# EAGLE design AB-AudioMatrix-6x6 (EAGLE 9.5.2)
DATE: 26.04.2020; EDITOR: HansAchterbahn; PROJECT: AB AudioMatrix 6x6; VERSION: v3.4

## Sheet 1 of 2
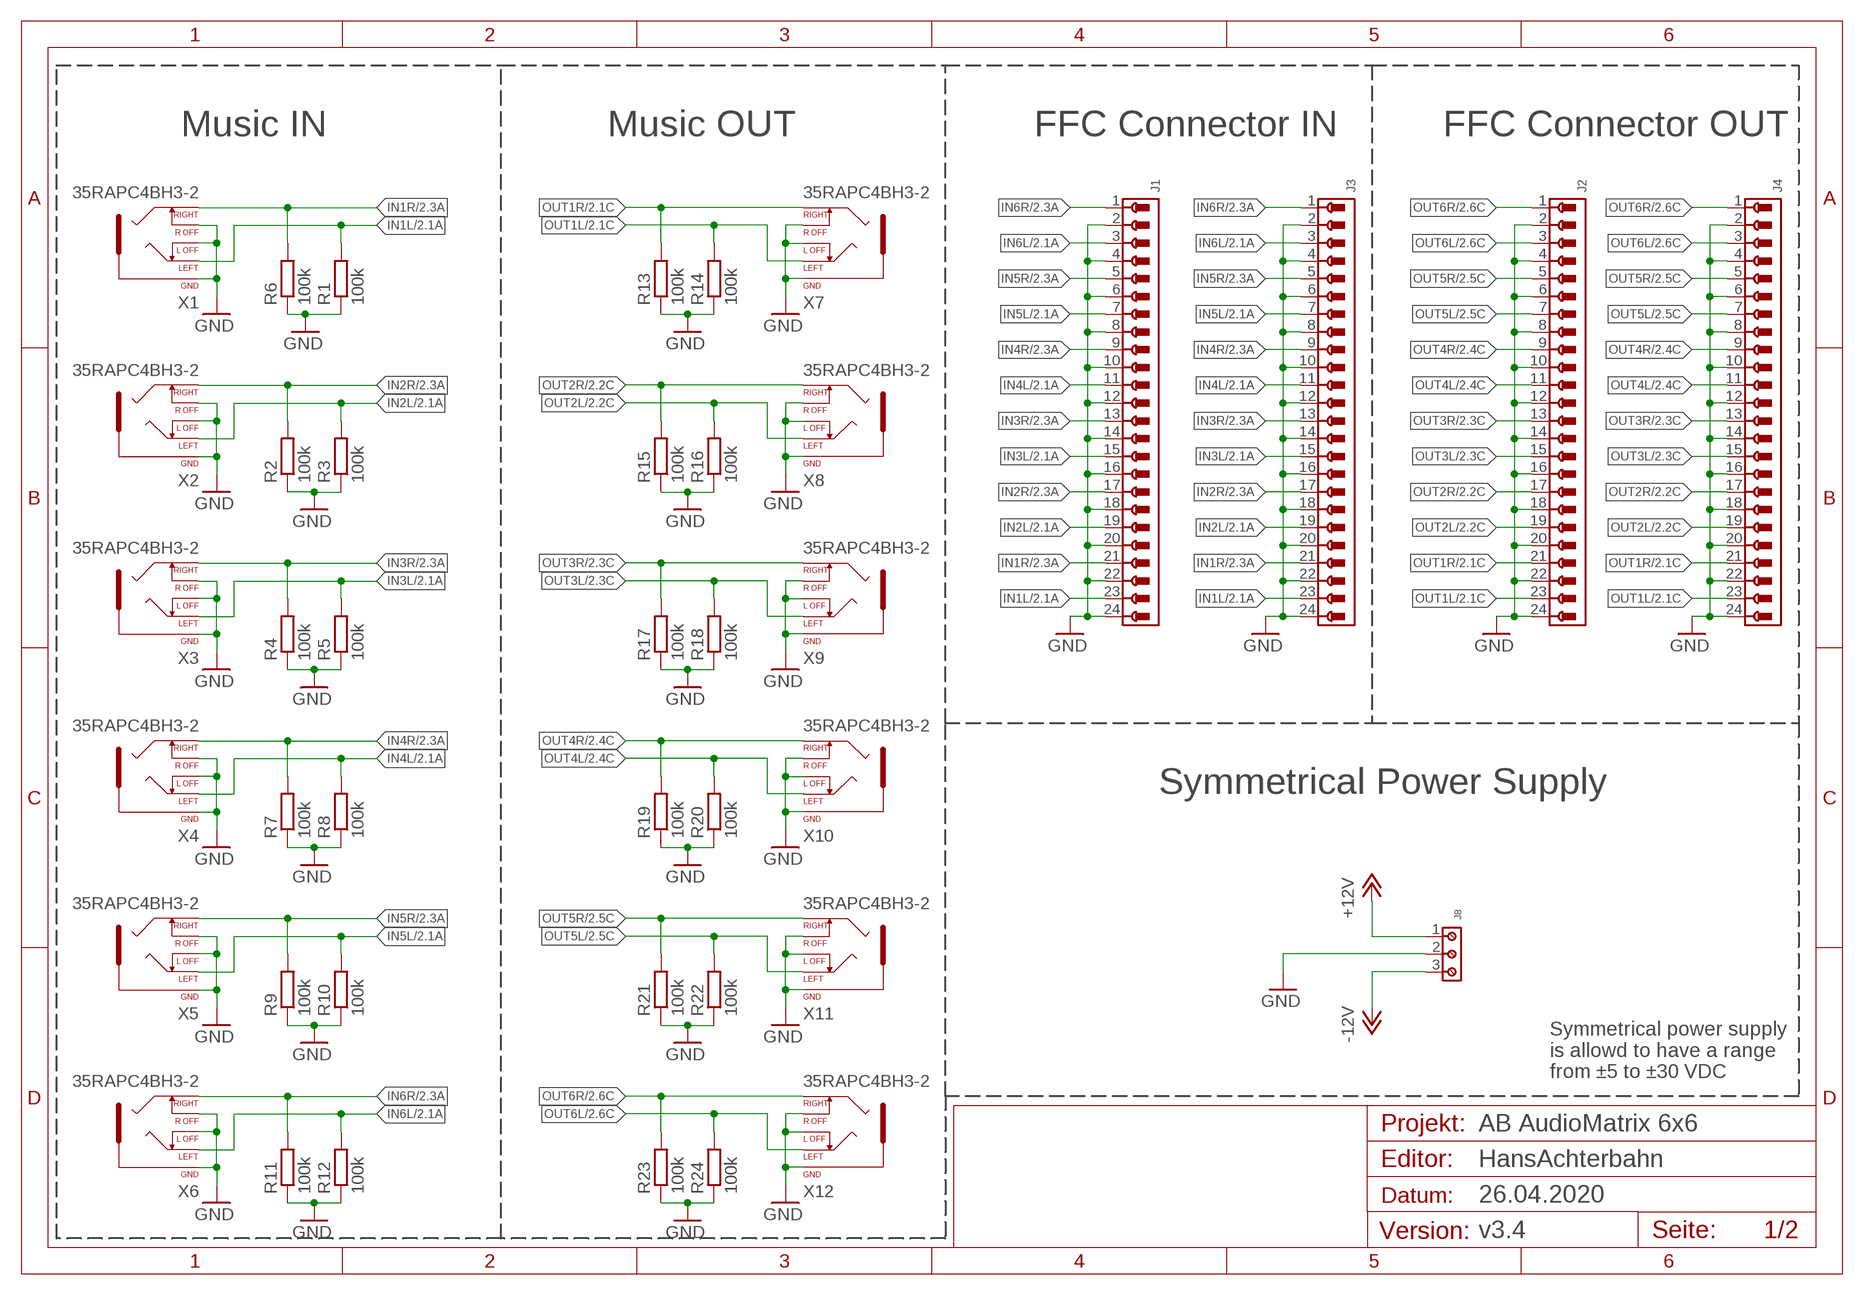
[diagram p0: schematic, sheet 1]

### Parts
J1  6861XX188622_686124188622  [686124188622]
J2  6861XX188622_686124188622  [686124188622]
J3  6861XX188622_686124188622  [686124188622]
J4  6861XX188622_686124188622  [686124188622]
J8  691102710003  [691102710003]
R1  100k  R-EU_R0603  [R0603]
R2  100k  R-EU_R0603  [R0603]
R3  100k  R-EU_R0603  [R0603]
R4  100k  R-EU_R0603  [R0603]
R5  100k  R-EU_R0603  [R0603]
R6  100k  R-EU_R0603  [R0603]
R7  100k  R-EU_R0603  [R0603]
R8  100k  R-EU_R0603  [R0603]
R9  100k  R-EU_R0603  [R0603]
R10  100k  R-EU_R0603  [R0603]
R11  100k  R-EU_R0603  [R0603]
R12  100k  R-EU_R0603  [R0603]
R13  100k  R-EU_R0603  [R0603]
R14  100k  R-EU_R0603  [R0603]
R15  100k  R-EU_R0603  [R0603]
R16  100k  R-EU_R0603  [R0603]
R17  100k  R-EU_R0603  [R0603]
R18  100k  R-EU_R0603  [R0603]
R19  100k  R-EU_R0603  [R0603]
R20  100k  R-EU_R0603  [R0603]
R21  100k  R-EU_R0603  [R0603]
R22  100k  R-EU_R0603  [R0603]
R23  100k  R-EU_R0603  [R0603]
R24  100k  R-EU_R0603  [R0603]
X1  35RAPC4BH3-2  [SWITCHCRAFT_35RAPC4BH3]
X2  35RAPC4BH3-2  [SWITCHCRAFT_35RAPC4BH3]
X3  35RAPC4BH3-2  [SWITCHCRAFT_35RAPC4BH3]
X4  35RAPC4BH3-2  [SWITCHCRAFT_35RAPC4BH3]
X5  35RAPC4BH3-2  [SWITCHCRAFT_35RAPC4BH3]
X6  35RAPC4BH3-2  [SWITCHCRAFT_35RAPC4BH3]
X7  35RAPC4BH3-2  [SWITCHCRAFT_35RAPC4BH3]
X8  35RAPC4BH3-2  [SWITCHCRAFT_35RAPC4BH3]
X9  35RAPC4BH3-2  [SWITCHCRAFT_35RAPC4BH3]
X10  35RAPC4BH3-2  [SWITCHCRAFT_35RAPC4BH3]
X11  35RAPC4BH3-2  [SWITCHCRAFT_35RAPC4BH3]
X12  35RAPC4BH3-2  [SWITCHCRAFT_35RAPC4BH3]

### Nets
+12V: J8.1 ; also sheet 2
-12V: J8.3 ; also sheet 2
GND: J1.2 J1.4 J1.6 J1.8 J1.10 J1.12 J1.14 J1.16 J1.18 J1.20 J1.22 J1.24 J2.2 J2.4 J2.6 J2.8 J2.10 J2.12 J2.14 J2.16 J2.18 J2.20 J2.22 J2.24 J3.2 J3.4 J3.6 J3.8 J3.10 J3.12 J3.14 J3.16 J3.18 J3.20 J3.22 J3.24 J4.2 J4.4 J4.6 J4.8 J4.10 J4.12 J4.14 J4.16 J4.18 J4.20 J4.22 J4.24 J8.2 R1.1 R2.1 R3.1 R4.1 R5.1 R6.1 R7.1 R8.1 R9.1 R10.1 R11.1 R12.1 R13.1 R14.1 R15.1 R16.1 R17.1 R18.1 R19.1 R20.1 R21.1 R22.1 R23.1 R24.1 X1.1(GND) X1.3(RIGHT_OFF) X1.4(LEFT_OFF) X2.1(GND) X2.3(RIGHT_OFF) X2.4(LEFT_OFF) X3.1(GND) X3.3(RIGHT_OFF) X3.4(LEFT_OFF) X4.1(GND) X4.3(RIGHT_OFF) X4.4(LEFT_OFF) X5.1(GND) X5.3(RIGHT_OFF) X5.4(LEFT_OFF) X6.1(GND) X6.3(RIGHT_OFF) X6.4(LEFT_OFF) X7.1(GND) X7.3(RIGHT_OFF) X7.4(LEFT_OFF) X8.1(GND) X8.3(RIGHT_OFF) X8.4(LEFT_OFF) X9.1(GND) X9.3(RIGHT_OFF) X9.4(LEFT_OFF) X10.1(GND) X10.3(RIGHT_OFF) X10.4(LEFT_OFF) X11.1(GND) X11.3(RIGHT_OFF) X11.4(LEFT_OFF) X12.1(GND) X12.3(RIGHT_OFF) X12.4(LEFT_OFF)
IN1L: J1.23 J3.23 R1.2 X1.5(LEFT) ; also sheet 2
IN1R: J1.21 J3.21 R6.2 X1.2(RIGHT) ; also sheet 2
IN2L: J1.19 J3.19 R3.2 X2.5(LEFT) ; also sheet 2
IN2R: J1.17 J3.17 R2.2 X2.2(RIGHT) ; also sheet 2
IN3L: J1.15 J3.15 R5.2 X3.5(LEFT) ; also sheet 2
IN3R: J1.13 J3.13 R4.2 X3.2(RIGHT) ; also sheet 2
IN4L: J1.11 J3.11 R8.2 X4.5(LEFT) ; also sheet 2
IN4R: J1.9 J3.9 R7.2 X4.2(RIGHT) ; also sheet 2
IN5L: J1.7 J3.7 R10.2 X5.5(LEFT) ; also sheet 2
IN5R: J1.5 J3.5 R9.2 X5.2(RIGHT) ; also sheet 2
IN6L: J1.3 J3.3 R12.2 X6.5(LEFT) ; also sheet 2
IN6R: J1.1 J3.1 R11.2 X6.2(RIGHT) ; also sheet 2
OUT1L: J2.23 J4.23 R14.2 X7.5(LEFT) ; also sheet 2
OUT1R: J2.21 J4.21 R13.2 X7.2(RIGHT) ; also sheet 2
OUT2L: J2.19 J4.19 R16.2 X8.5(LEFT) ; also sheet 2
OUT2R: J2.17 J4.17 R15.2 X8.2(RIGHT) ; also sheet 2
OUT3L: J2.15 J4.15 R18.2 X9.5(LEFT) ; also sheet 2
OUT3R: J2.13 J4.13 R17.2 X9.2(RIGHT) ; also sheet 2
OUT4L: J2.11 J4.11 R20.2 X10.5(LEFT) ; also sheet 2
OUT4R: J2.9 J4.9 R19.2 X10.2(RIGHT) ; also sheet 2
OUT5L: J2.7 J4.7 R22.2 X11.5(LEFT) ; also sheet 2
OUT5R: J2.5 J4.5 R21.2 X11.2(RIGHT) ; also sheet 2
OUT6L: J2.3 J4.3 R24.2 X12.5(LEFT) ; also sheet 2
OUT6R: J2.1 J4.1 R23.2 X12.2(RIGHT) ; also sheet 2

### Notes on the sheet
- Music IN | Music OUT | FFC Connector IN | FFC Connector OUT
- Symmetrical Power Supply
- Symmetrical power supply 
  is allowd to have a range 
  from ±5 to ±30 VDC

## Sheet 2 of 2
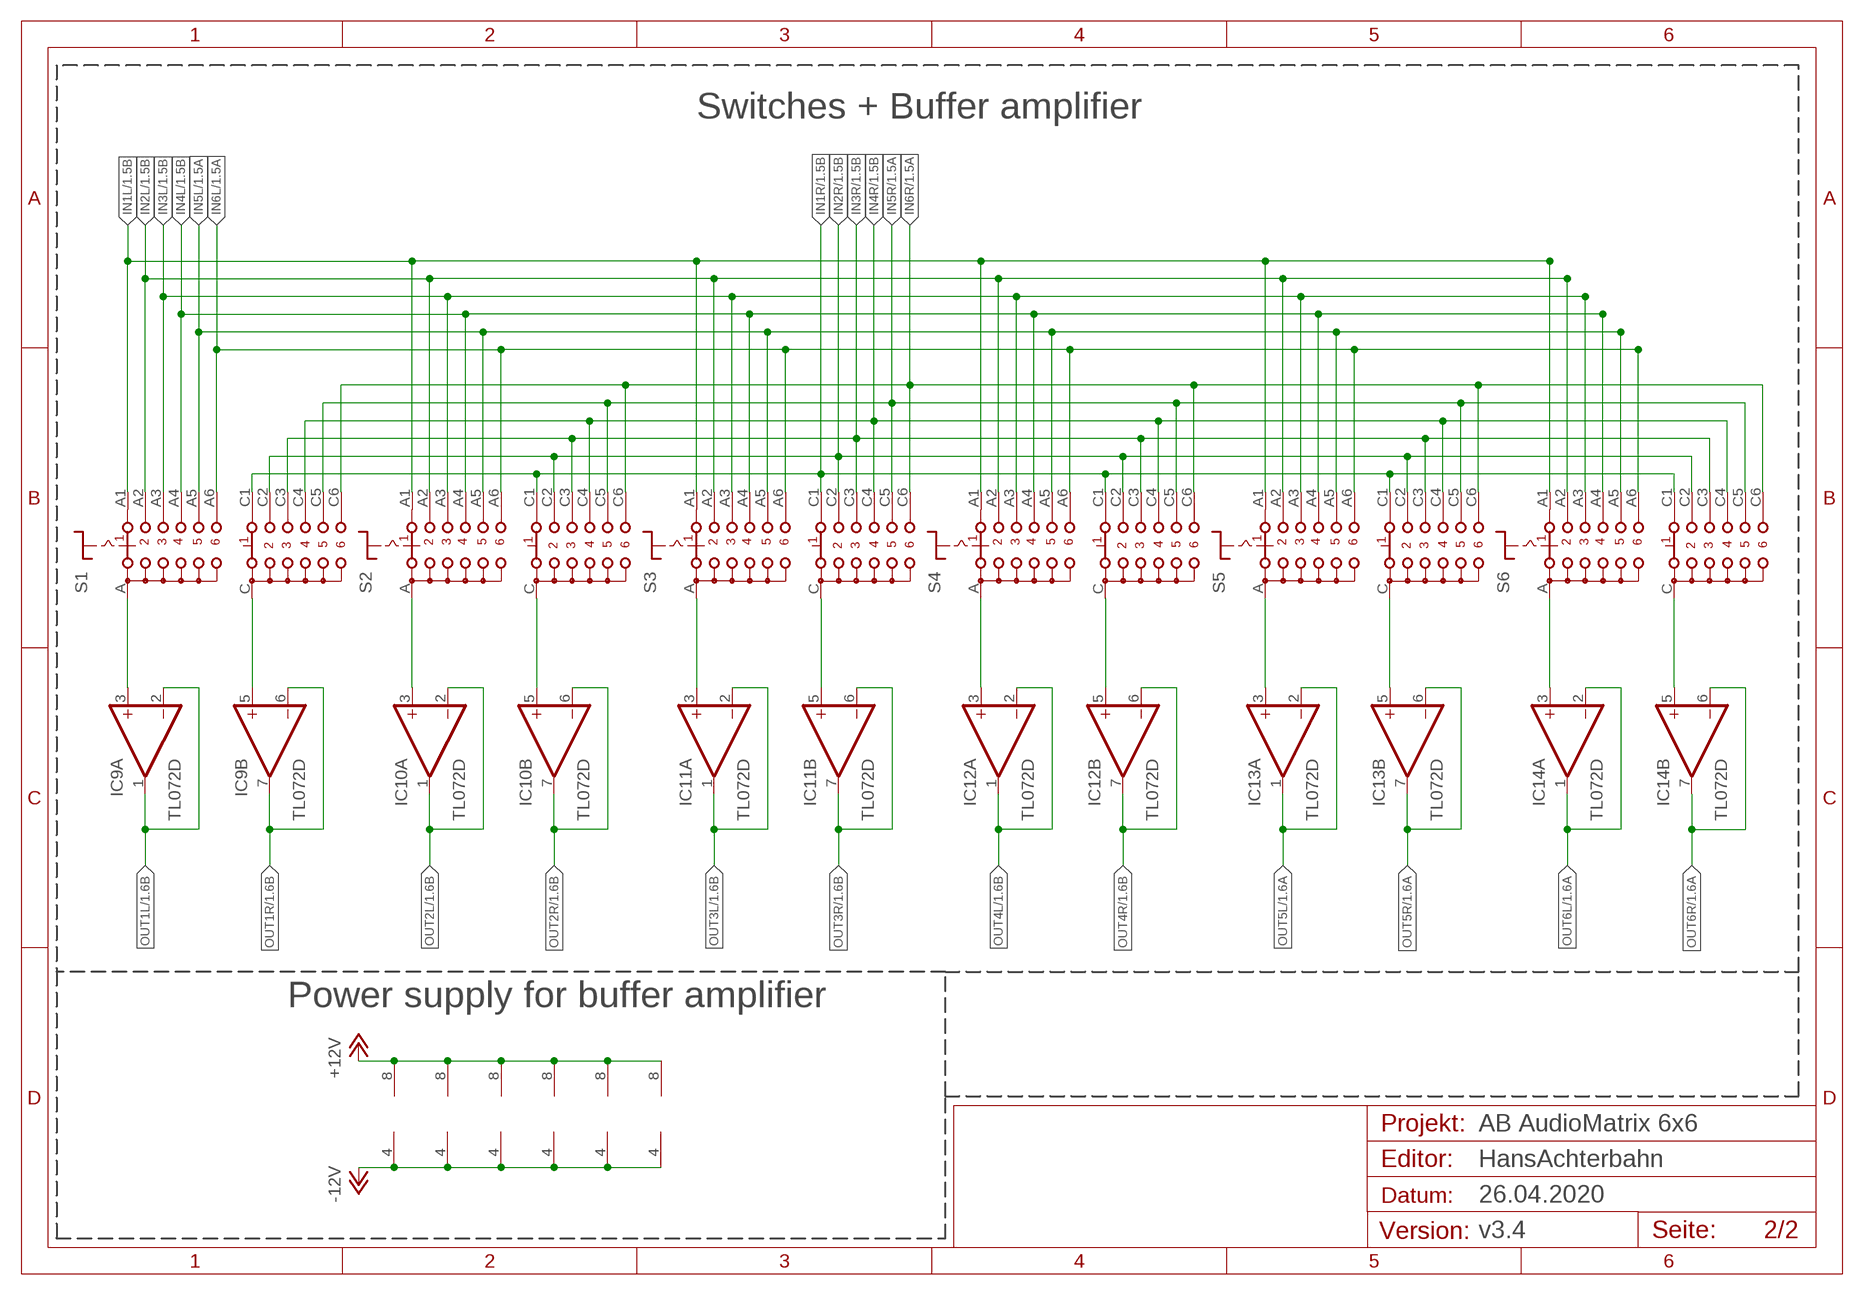
[diagram p1: schematic, sheet 2]

### Parts
IC9  TL072D  [SO08]
IC10  TL072D  [SO08]
IC11  TL072D  [SO08]
IC12  TL072D  [SO08]
IC13  TL072D  [SO08]
IC14  TL072D  [SO08]
S1  CK102X06  [CK102X06]
S2  CK102X06  [CK102X06]
S3  CK102X06  [CK102X06]
S4  CK102X06  [CK102X06]
S5  CK102X06  [CK102X06]
S6  CK102X06  [CK102X06]

### Nets
+12V: IC9.8(P:V+) IC10.8(P:V+) IC11.8(P:V+) IC12.8(P:V+) IC13.8(P:V+) IC14.8(P:V+) ; also sheet 1
-12V: IC9.4(P:V-) IC10.4(P:V-) IC11.4(P:V-) IC12.4(P:V-) IC13.4(P:V-) IC14.4(P:V-) ; also sheet 1
IN1L: S1.A1 S2.A1 S3.A1 S4.A1 S5.A1 S6.A1 ; also sheet 1
IN1R: S1.C1 S2.C1 S3.C1 S4.C1 S5.C1 S6.C1 ; also sheet 1
IN2L: S1.A2 S2.A2 S3.A2 S4.A2 S5.A2 S6.A2 ; also sheet 1
IN2R: S1.C2 S2.C2 S3.C2 S4.C2 S5.C2 S6.C2 ; also sheet 1
IN3L: S1.A3 S2.A3 S3.A3 S4.A3 S5.A3 S6.A3 ; also sheet 1
IN3R: S1.C3 S2.C3 S3.C3 S4.C3 S5.C3 S6.C3 ; also sheet 1
IN4L: S1.A4 S2.A4 S3.A4 S4.A4 S5.A4 S6.A4 ; also sheet 1
IN4R: S1.C4 S2.C4 S3.C4 S4.C4 S5.C4 S6.C4 ; also sheet 1
IN5L: S1.A5 S2.A5 S3.A5 S4.A5 S5.A5 S6.A5 ; also sheet 1
IN5R: S1.C5 S2.C5 S3.C5 S4.C5 S5.C5 S6.C5 ; also sheet 1
IN6L: S1.A6 S2.A6 S3.A6 S4.A6 S5.A6 S6.A6 ; also sheet 1
IN6R: S1.C6 S2.C6 S3.C6 S4.C6 S5.C6 S6.C6 ; also sheet 1
N$63: IC14.5(B:+IN) S6.C
N$64: IC14.3(A:+IN) S6.A
N$65: IC13.3(A:+IN) S5.A
N$66: IC12.3(A:+IN) S4.A
N$67: IC9.3(A:+IN) S1.A
N$68: IC12.5(B:+IN) S4.C
N$69: IC10.3(A:+IN) S2.A
N$70: IC13.5(B:+IN) S5.C
N$71: IC11.5(B:+IN) S3.C
N$72: IC11.3(A:+IN) S3.A
N$73: IC10.5(B:+IN) S2.C
N$74: IC9.5(B:+IN) S1.C
OUT1L: IC9.1(A:OUT) IC9.2(A:-IN) ; also sheet 1
OUT1R: IC9.6(B:-IN) IC9.7(B:OUT) ; also sheet 1
OUT2L: IC10.1(A:OUT) IC10.2(A:-IN) ; also sheet 1
OUT2R: IC10.6(B:-IN) IC10.7(B:OUT) ; also sheet 1
OUT3L: IC11.1(A:OUT) IC11.2(A:-IN) ; also sheet 1
OUT3R: IC11.6(B:-IN) IC11.7(B:OUT) ; also sheet 1
OUT4L: IC12.1(A:OUT) IC12.2(A:-IN) ; also sheet 1
OUT4R: IC12.6(B:-IN) IC12.7(B:OUT) ; also sheet 1
OUT5L: IC13.1(A:OUT) IC13.2(A:-IN) ; also sheet 1
OUT5R: IC13.6(B:-IN) IC13.7(B:OUT) ; also sheet 1
OUT6L: IC14.1(A:OUT) IC14.2(A:-IN) ; also sheet 1
OUT6R: IC14.6(B:-IN) IC14.7(B:OUT) ; also sheet 1

### Notes on the sheet
- Switches + Buffer amplifier
- Power supply for buffer amplifier

## Library data of the parts
IC9-IC14 = linear:TL072: OP AMP
J1-J4 = Wurth_Connectors_WR-FPC:6861XX188622_686124188622: 1.00 mm SMT LIF Horizontal Top Contact KIND PROPERTIES Pitch 1 mm MATERIAL PROPERTIES Insulator Material LCP Contact Material Phosphor Bronze Contact Plating 2.032µm Tin over 1.27µm Nickel Contact Type Stamped Solder Tabs Brass Details see: https://katalog.we-online.com/en/em/FPC_1_00_SMT_LIF_HORIZONTAL_TOP_CONTACT_6861xx188622 Updated by Yingchun,Shan 2019-11-21 2019(C) Wurth Elektronik; CONTACT-RESISTANCE: 30Ohm; DATASHEET-URL: https://www.we-online.com/catalog/datasheet/686124188622.pdf; IR: 1A; L: 27.8mm; PACKAGING: Tape and Reel; PART-NUMBER: 686124188622; PINS: 24; PITCH: 1mm; TOL-R: max.; TYPE: Horizontal; WORKING-VOLTAGE: 125V(AC)
J8 = Wurth_Connectors_WR-TBL Wire Protector:691102710003: WR-TBL Serie 102 - 5.00 mm Horiz. Entry Modular KIND PROPERTIES Pitch 5 mm MATERIAL PROPERTIES Insulator Material PA66 Insulator Flammability Rating UL94 V-0 Insulator Color Blue Contact Material Brass Contact Plating Copper over Zinc Terminal Screw Material Steel Terminal Screw Plating Zinc Wire Guard Material Stainless Steel GENERAL INFORMATION Operating Temperature -40 up to +105 °C Compliance Lead free / RoHS ELECTRICAL PROPERTIES IR cULus 15 A IR VDE 17.5 A Working Voltage [cULus] 300 V (AC) Working Voltage [VDE] 250 V (AC) Withstanding Voltage [UL] 1600 V (AC) Withstanding Voltage [cULus] 1600 V (AC) Withstanding Voltage [VDE] 2000 V (AC) Contact Resistance [UL] 20 mΩ Contact Resistance [cULus] 20 mΩ Contact Resistance [VDE] 20 mΩ MECHANICAL PROPERTIES Wire Strip Length 5 up to 6 (mm) Screw M2.6 Solid Wire Section (AWG) 22 to 14 (AWG) Solid Wire Section (Metric) 0.326 to 2.08 (mm²) Stranded Wire Section (AWG) 22 to 14 (AWG) Stranded Wire Section (Metric) 0.326 to 2.08 (mm²) CERTIFICATION cULus Approval E315414 UL Approval E315414 VDE Approval 40022612 VDE Approval 40022612 Model number 102 PACKAGING PROPERTIES Packaging Box Details see: https://katalog.we-online.com/en/em/TBL_5_00_102_6911027100XX Updated by Ella Wu 2019-11-07 2019(C) Wurth Elektronik; DATASHEET-URL: https://www.we-online.com/catalog/datasheet/691102710003.pdf; IR-UL: 15A; IR-VDE: 17.5A; MOUNT: THT; PART-NUMBER: 691102710003; PINS: 3; PITCH: 5mm; TYPE: Horizontal; WIRE: 22 to 14 (AWG) 0.326 to 2.08 (mm²); WORKING-VOLTAGE-UL: 300V(AC); WORKING-VOLTAGE-VDE: 250V(AC)
R1-R24 = rcl:R-EU_: RESISTOR, European symbol; MF: Vishay; MFN: CRCW0603100KFKEA; MOUSER: 71-CRCW0603-100K-E3; RS-ONLINE: 678-9673; SPICEPREFIX: R
S1-S6 = switch:CK102X06: ROTARY SWITCH C&K; MF: Lorlin; MFN: CK1050; MOUSER: 10WA145; RS-ONLINE: 665-196
X1-X12 = h8-conector:35RAPC4BH3-2: Conn 3.5MM Stereo Jack F 5 POS Solder RA Thru-Hole 5 Terminal 1 Port; DESCRIPTION: 3.50mm _0.141, 1/8, Mini Plug_ - Headphone Phone Jack Stereo _3 Conductor, TRS_ Connector Solder; DIGI-KEY: SC1464-ND; MF: Switchcraft; MFN: 35RAPC4BH3; MOUSER: 502-35RAPC4BH3; PACKAGE: None; RS-ONLINE: 878-7229

## Net classes
0 default: clearance 0.2 mm

## Board
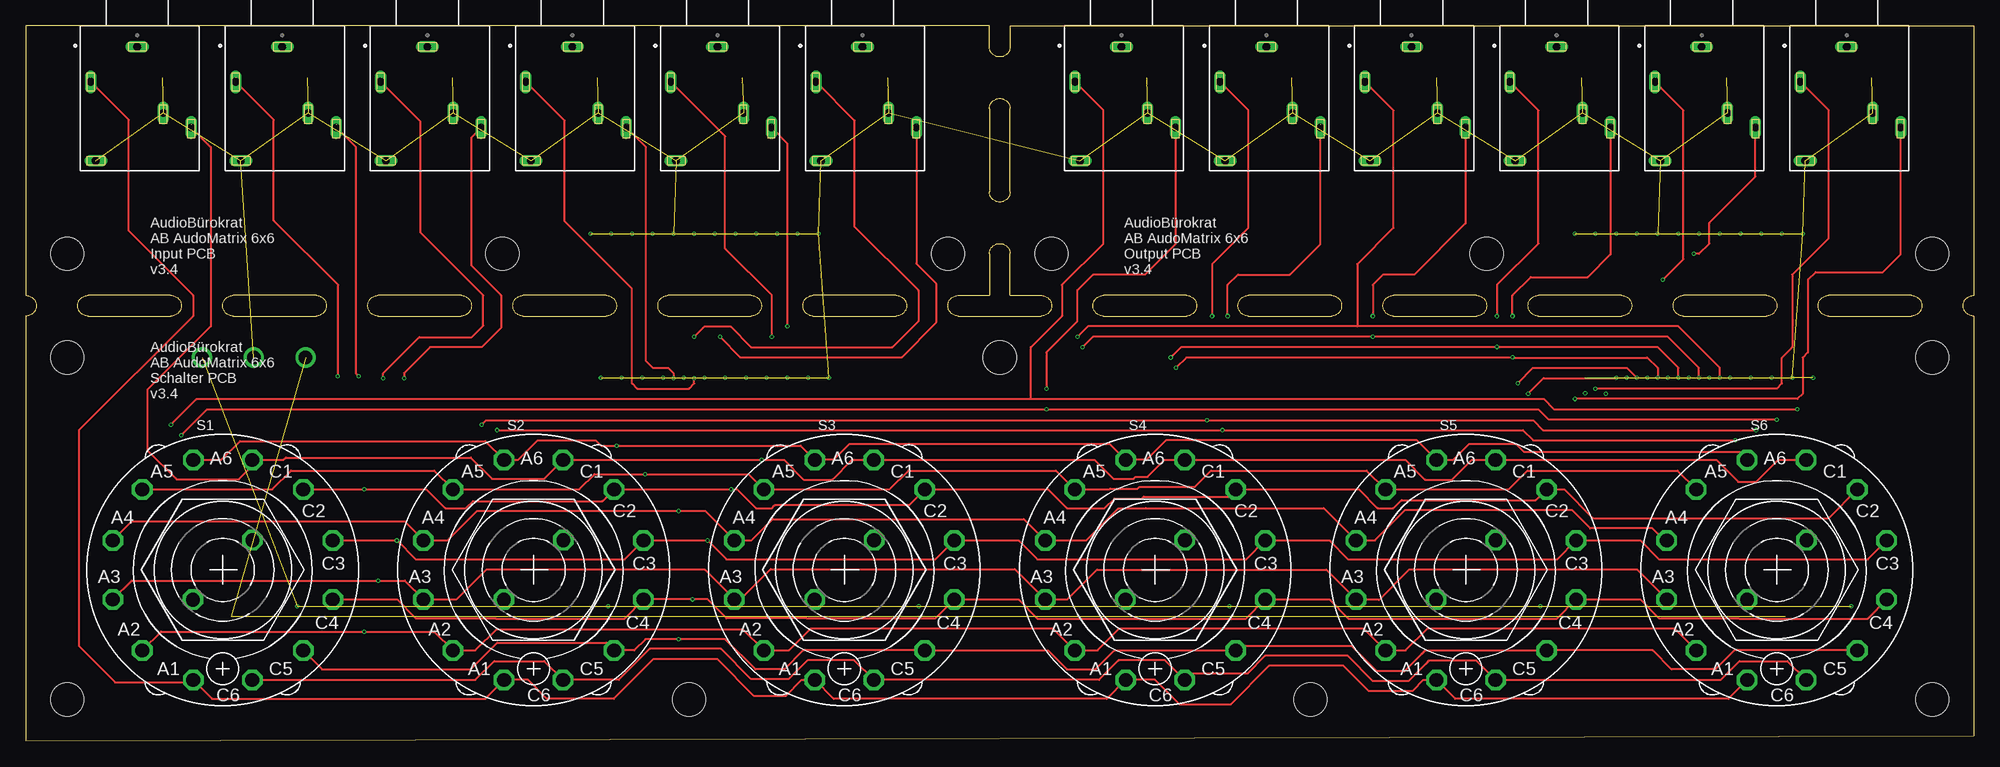
[diagram p2: board, top side]
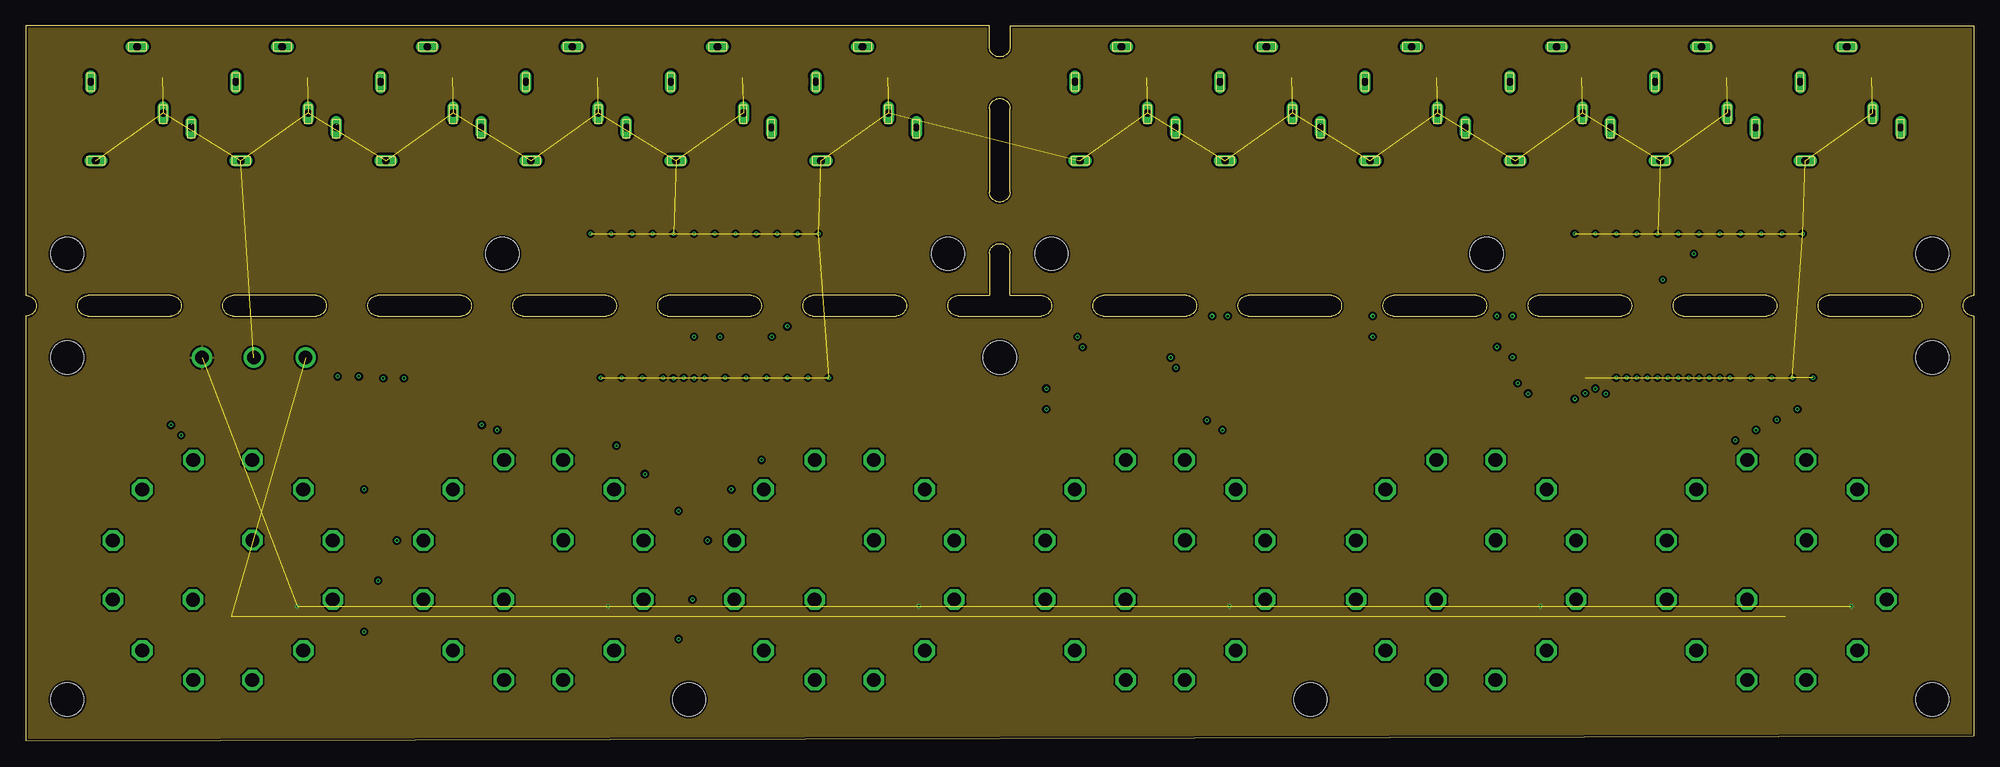
[diagram p3: board, inner layer +12V]
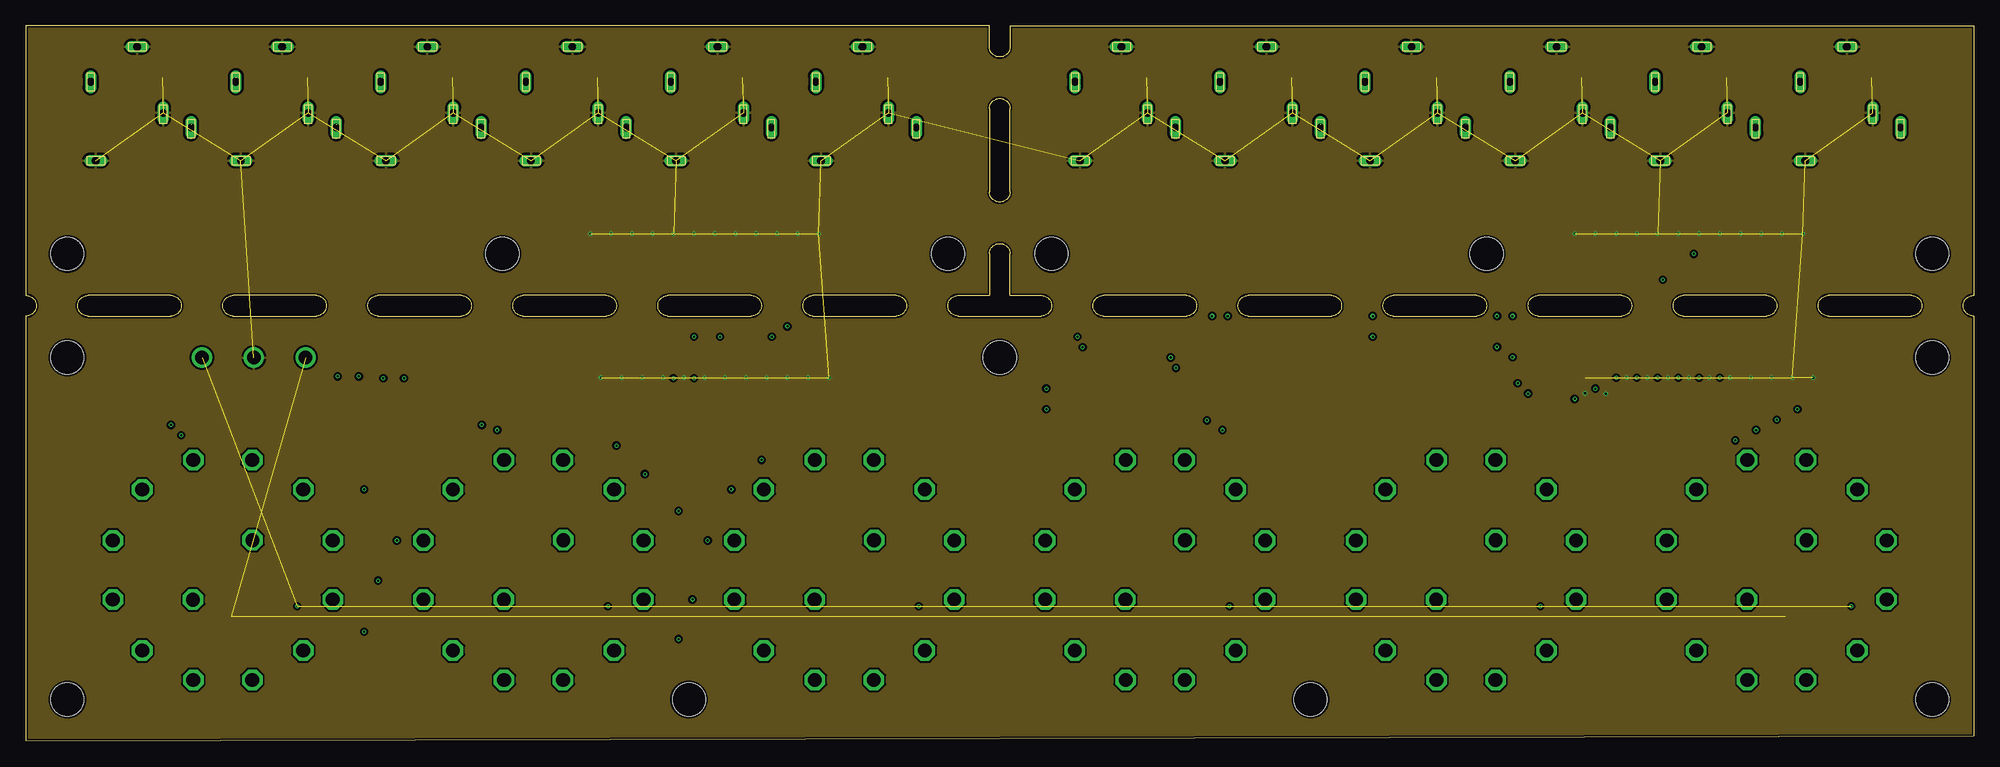
[diagram p4: board, inner layer GND]
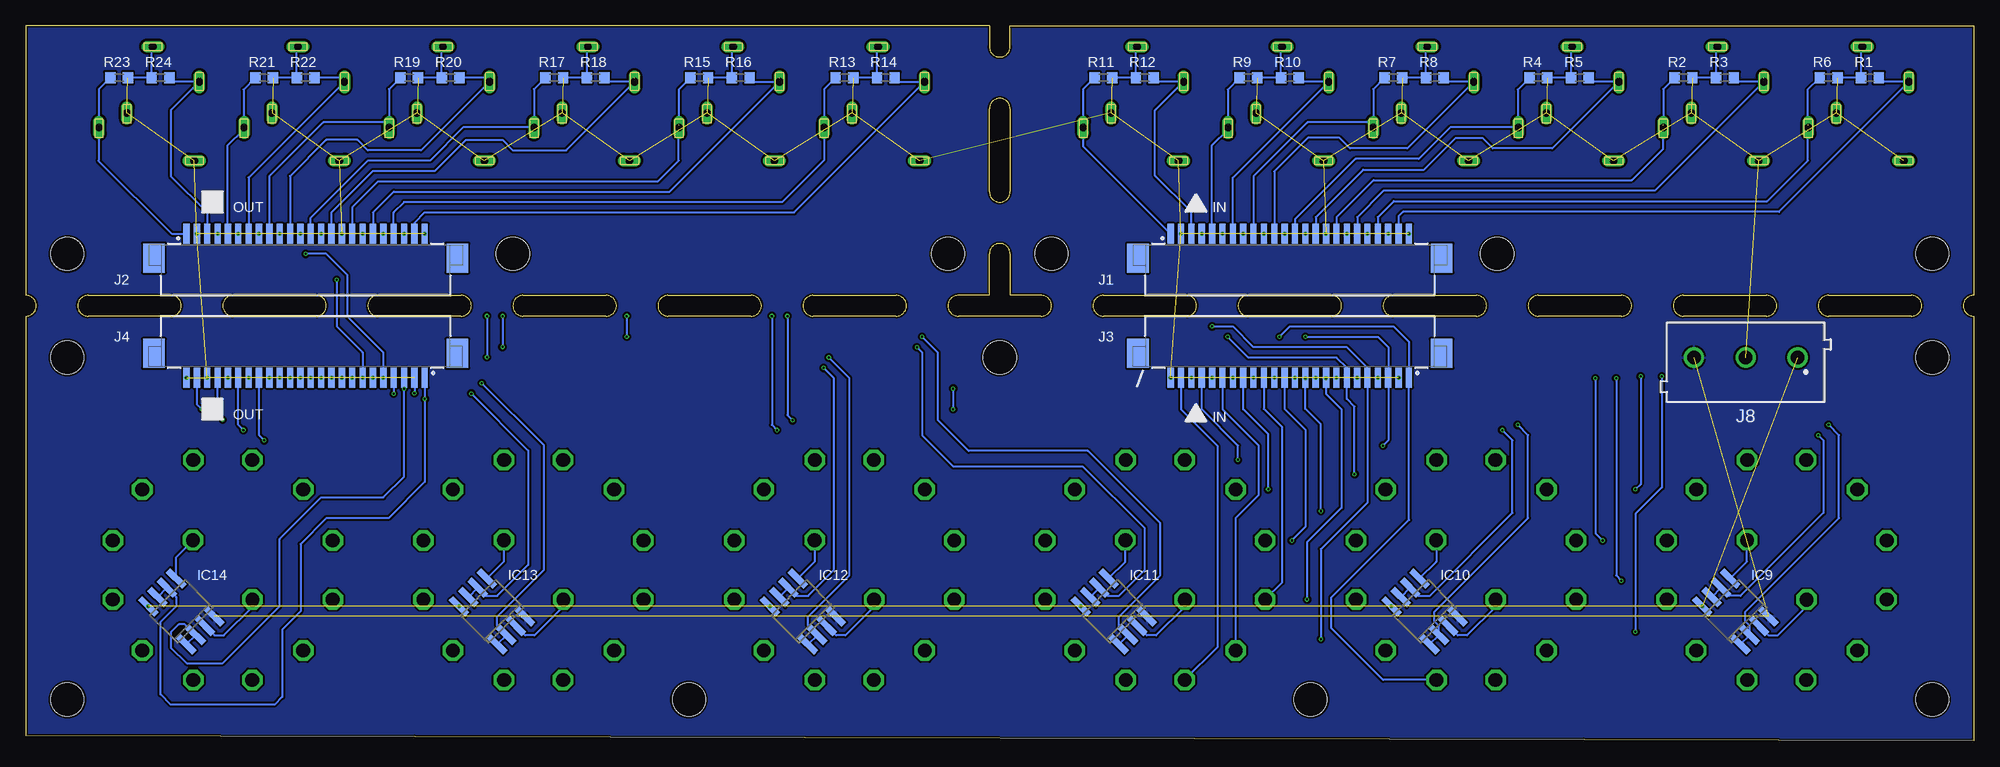
[diagram p5: board, bottom side, seen from below]

Size 188 x 69 mm. Coordinates in mm from the lower left corner, seen from the top.
Outline: 72 segments
Copper layers (1+2*3+16): Top 0.018mm / dielectric 0.36mm / +12V 0.035mm / dielectric 0.71mm / GND 0.035mm / dielectric 0.36mm / Bottom 0.018mm
Design rules "Multi-CB_4L_100æm-Tracks_OL35æm-IL35æm": minimum track width 0.1mm, minimum drill 0.2mm, track to track 0.1mm, track to pad 0.1mm, pad to pad 0.1mm, via to via 0.1mm, smd to smd 0mil, copper to edge 0.2mm, drill to drill 0.2mm, minimum pad ring 0.125mm, minimum via ring 0.1mm, stop-mask expansion 2mil, vias tented up to drill 0.45mm, thermal gap 0.2mm
Holes 3.2 mm at 4,4 4,37 184,37 4,47 99,47 89,47 184,47 46,47 141,47 94,37 184,4 124,4 64,4

### Footprints (pad centres in the part's own frame; a part is rotated, then mirrored left to right if it is on the bottom)
SO08 = smd 0.6 x 2.2: 1 -1.905,-2.6; 2 -0.635,-2.6; 3 0.635,-2.6; 4 1.905,-2.6; 5 1.905,2.6; 6 0.635,2.6; 7 -0.635,2.6; 8 -1.905,2.6
686124188622 = smd 0.6 x 1.9: 1 -11.5,2.95; 2 -10.5,2.95; 3 -9.5,2.95; 4 -8.5,2.95; 5 -7.5,2.95; 6 -6.5,2.95; 7 -5.5,2.95; 8 -4.5,2.95; 9 -3.5,2.95; 10 -2.5,2.95; 11 -1.5,2.95; 12 -0.5,2.95; 13 0.5,2.95; 14 1.5,2.95; 15 2.5,2.95; 16 3.5,2.95; 17 4.5,2.95; 18 5.5,2.95; 19 6.5,2.95; 20 7.5,2.95; 21 8.5,2.95; 22 9.5,2.95; 23 10.5,2.95; 24 11.5,2.95 | smd 2.1 x 2.8: Z1 -14.65,0.6; Z2 14.65,0.6
691102710003 = drill 1.3: 1 -5,0; 2 0,0; 3 5,0
R0603 = smd 1 x 1.1: 1 -0.85,0; 2 0.85,0
CK102X06 = drill 1.321 octagon: A -2.87,-2.87; A1 -2.845,-10.617; A2 -7.772,-7.772; A3 -10.617,-2.845; A4 -10.617,2.845; A5 -7.772,7.772; A6 -2.845,10.617; C 2.87,2.87; C1 2.845,10.617; C2 7.772,7.772; C3 10.617,2.845; C4 10.617,-2.845; C5 7.772,-7.772; C6 2.845,-10.617
SWITCHCRAFT_35RAPC4BH3 = drill 0.75 long: 1 -5,-0.25; 2 2.8,4.95; 3 1.4,2.25; 4 6,-4.25; 5 -1.6,-4.75

### Placement (x,y rotation side)
IC9  23,12.5 45 bottom
IC10  53,12.5 45 bottom
IC11  83,12.5 45 bottom
IC12  113,12.5 45 bottom
IC13  143,12.5 45 bottom
IC14  173,12.5 45 bottom
J1  66,46 0 bottom
J2  161,46 0 bottom
J3  66,38 180 bottom
J4  161,38 180 bottom
J8  22,37 180 bottom
R1  10,64 0 bottom
R2  28,64 180 bottom
R3  24,64 0 bottom
R4  42,64 180 bottom
R5  38,64 0 bottom
R6  14,64 180 bottom
R7  56,64 180 bottom
R8  52,64 0 bottom
R9  70,64 180 bottom
R10  66,64 0 bottom
R11  84,64 180 bottom
R12  80,64 0 bottom
R13  109,64 180 bottom
R14  105,64 0 bottom
R15  123,64 180 bottom
R16  119,64 0 bottom
R17  137,64 180 bottom
R18  133,64 0 bottom
R19  151,64 180 bottom
R20  147,64 0 bottom
R21  165,64 180 bottom
R22  161,64 0 bottom
R23  179,64 180 bottom
R24  175,64 0 bottom
S1  19,16.5 0 top
S2  49,16.5 0 top
S3  79,16.5 0 top
S4  109,16.5 0 top
S5  139,16.5 0 top
S6  169,16.5 0 top
X1  11,62 270 top
X2  25,62 270 top
X3  39,62 270 top
X4  53,62 270 top
X5  67,62 270 top
X6  81,62 270 top
X7  106,62 270 top
X8  120,62 270 top
X9  134,62 270 top
X10  148,62 270 top
X11  162,62 270 top
X12  176,62 270 top

### Tracks (layer width: path | path; a pad name or v marks a point on that pad's centre or on a via)
+12V  (via drill 0.2 pad 0.2)  (6 unrouted)
  other vias: 26.19,12.99 56.19,12.99 86.19,12.99 116.19,12.99 146.19,12.99 176.19,12.99
  pour +12V: -2,71 -2,-5 190,-5 190,71
-12V  (6 unrouted)
  pour Bottom: -2,-1.5 190,-1.5 190,71 -2,71
GND  (via drill 0.2 pad 0.2)  (84 unrouted)
  Bottom 0.2: J4.2 v150.5,33.55 | J4.4 v152.5,33.5 | R13.1 R14.1 105.85,66.9 X7.1 | R15.1 R16.1 119.85,66.9 X8.1 | R17.1 R18.1 133.85,66.9 X9.1 | R19.1 R20.1 147.85,66.9 X10.1 | R21.1 R22.1 161.85,66.9 X11.1 | R23.1 R24.1 175.85,66.9 X12.1 | R6.1 R1.1 10.85,66.9 X1.1 | R2.1 R3.1 24.85,66.9 X2.1 | X3.1 38.85,66.9 R5.1 R4.1 | R7.1 R8.1 52.85,66.9 X4.1 | R9.1 R10.1 66.85,66.9 X5.1 | R11.1 R12.1 80.85,66.9 X6.1
  other vias: 76.5,48.95 74.5,48.95 72.5,48.95 70.5,48.95 68.5,48.95 66.5,48.95 64.5,48.95 62.5,48.95 60.5,48.95 58.5,48.95 56.5,48.95 54.5,48.95 55.5,35.05 57.5,35.05 59.5,35.05 61.5,35.05 63.5,35.05 65.5,35.05 67.5,35.05 69.5,35.05 71.5,35.05 73.5,35.05 75.5,35.05 77.5,35.05 154.5,35.05 156.5,35.05 158.5,35.05 160.5,35.05 162.5,35.05 164.5,35.05 166.5,35.05 168.5,35.05 170.5,35.05 172.5,35.05 149.5,48.95 151.5,48.95 153.5,48.95 155.5,48.95 157.5,48.95 159.5,48.95 161.5,48.95 163.5,48.95 165.5,48.95 167.5,48.95 169.5,48.95 171.5,48.95
  pour GND: -2,71 -2,-5 190,-5 190,71
IN1L
  Top 0.2: S6.A1 164.34,4.07 137.97,4.07 S5.A1 134.91,5.88 133.83,4.81 129.62,4.81 127.19,7.24 120,7.24 116.26,3.5 111.38,3.5 109,5.88 S4.A1 104.34,4.07 77.97,4.07 S3.A1 74.89,5.88 73.34,4.33 70.3,4.33 66.7,7.92 60.6,7.92 56.74,4.07 50.28,4.07 48.46,5.88 S2.A1 44.34,4.07 17.97,4.07 16.38,5.66 | S1.A1 16.38,5.66 | 16.38,5.66 8.61,5.66 5.1,9.17 5.1,29.96 16.14,41 16.14,43 9.93,49.22 9.93,59.92 X1.5
  Bottom 0.2: J3.23 76.5,32 73,28.5 73,9.04 S3.A1 | J1.23 55.5,50.64 55.08,51.06 18.79,51.06 X1.5 8.75,63.6 R1.2
IN1R  (via drill 0.2 pad 0.2)
  Top 0.2: S6.C1 169.15,27.12 167.03,25 165.28,25 163.16,27.12 S5.C1 139.56,27.12 137.66,25.23 135.05,25.23 133.16,27.12 S4.C1 109.91,27.12 108.27,25.48 107.08,25.48 106.91,25.3 104.98,25.3 103.16,27.12 S3.C1 79.73,27.12 77.84,25.23 75.05,25.23 73.16,27.12 v71,27.12 S2.C1 50.03,25.3 44.98,25.3 42.93,27.34 25.08,27.34 24.85,27.12 22.44,27.12 | S1.C1 22.44,27.12 | 22.44,27.12 20.56,25.23 14.54,25.23 11.73,28.04 11.73,33.87 17.86,40 17.86,57.29 X1.2
  Bottom 0.2: J3.21 74.5,32 71,28.5 v71,27.12 | J1.21 57.5,50.55 55.97,52.08 19.92,52.08 16,56 16,58.97 16.04,59 16.04,59.12 | 16.04,59.12 X1.2 | R6.2 16.04,62.81 16.04,59.12
IN2L  (via drill 0.2 pad 0.2)
  Top 0.2: S6.A2 159.1,10.86 135.31,10.86 133.18,8.73 S5.A2 129.1,10.86 105.58,10.86 103.45,8.73 S4.A2 99.1,10.86 75.77,10.86 73.64,8.73 S3.A2 69.17,10.78 45.44,10.78 43.38,8.73 S2.A2 39.41,10.54 v32.64,10.54 13.04,10.54 S1.A2 | v30.09,35.18 30.14,35.23 30.14,44 23.93,50.22 23.93,59.92 X2.5
  Bottom 0.2: J3.19 72.5,32 69.04,28.54 69.04,23.69 71.23,21.5 S3.A2 | v32.64,10.54 32.64,21.92 30.09,24.47 v30.09,35.18 | J1.19 59.5,50.55 56.95,53.1 30.75,53.1 X2.5 22.75,63.6 R3.2
IN2R  (via drill 0.2 pad 0.2)
  Top 0.2: S1.C2 v32.64,24.27 38.66,24.27 40.48,22.45 42.47,22.45 43.16,23.14 55.65,23.14 S2.C2 v68.08,24.27 68.66,24.27 70.47,22.45 72,22.45 72.28,22.73 85.23,22.73 S3.C2 98.66,24.27 100.47,22.45 104.12,22.45 105.06,23.39 107.7,23.39 107.88,23.57 116.07,23.57 S4.C2 128.66,24.27 130.47,22.45 131.98,22.45 132.77,23.25 145.75,23.25 S5.C2 148.5,24.27 151.27,21.5 174,21.5 S6.C2 | v32.13,35.18 31.86,35.45 31.86,57.29 X2.2
  Bottom 0.2: J3.17 70.5,32 68.08,29.59 v68.08,24.27 | v32.13,35.18 32.13,24.78 v32.64,24.27 | 29.96,59 X2.2 | J1.17 61.5,50.55 57.93,54.12 33,54.12 29.96,57.16 29.96,59 | R2.2 29.96,62.89 29.96,59
IN3L  (via drill 0.2 pad 0.2)
  Top 0.2: S6.A3 155.49,16.55 133.55,16.55 130.59,13.59 130.53,13.65 S5.A3 125.52,16.52 103.4,16.52 100.53,13.65 S4.A3 95.46,16.58 71.9,16.58 68.98,13.65 S3.A3 65.49,16.55 44.47,16.55 41.57,13.65 S2.A3 36.56,15.47 v34,15.47 10.2,15.47 S1.A3 | v34.5,35 34.5,35.5 37.96,38.96 43.04,38.96 44.14,40.07 44.14,43 38.07,49.07 38.07,59.78 X3.5
  Bottom 0.2: J3.15 68.5,32.05 66.75,30.3 66.75,15.29 S3.A3 | J1.15 63.5,50.55 58.91,55.14 53.04,55.14 49.98,58.2 47.43,58.2 46.41,57.18 40.67,57.18 X3.5 36.75,63.6 R5.2 | v34.5,35 34.5,15.97 v34,15.47
IN3R  (via drill 0.2 pad 0.2)
  Top 0.2: S1.C3 v35.81,19.34 37.63,17.53 57.8,17.53 S2.C3 v65.81,19.34 67.63,17.53 71.5,17.53 71.51,17.53 87.81,17.53 S3.C3 95.81,19.34 97.63,17.53 117.8,17.53 S4.C3 125.81,19.34 127.63,17.53 147.8,17.53 S5.C3 155.81,19.34 157.63,17.53 177.8,17.53 S6.C3 | v36.5,35 36.5,35.5 39,38 44,38 45.86,39.86 45.86,43 43,45.86 43,58.25 X3.2
  Bottom 0.2: J3.13 66.5,32.05 64.5,30.05 64.5,20.66 v65.81,19.34 | J1.13 65.5,50.33 59.67,56.16 53.55,56.16 50.51,59.2 44,59.2 | v36.5,35 36.5,20.03 v35.81,19.34 | X3.2 44,59.2 | R4.2 44,62.85 44,59.2
IN4L  (via drill 0.2 pad 0.2)
  Top 0.2: S1.A4 10.23,21.19 36.54,21.19 S2.A4 40.7,19.34 43.55,22.19 v63,22.19 65.54,22.19 S3.A4 70.04,19.34 72.09,21.39 96.33,21.39 S4.A4 102.36,19.34 105.45,22.44 108.09,22.44 108.11,22.45 125.27,22.45 S5.A4 130.22,19.34 133.17,22.29 149.21,22.29 151,20.5 157,20.5 158.16,19.34 S6.A4 | v64.5,35 64.5,34.5 64,34 59,34 58.5,34.5 58.5,43.64 52,50.14 52,59.85 X4.5
  Bottom 0.2: v63,22.19 63,30.55 64.5,32.05 J3.11 v64.5,35 | J1.11 67.5,54.96 64.26,58.2 61.2,58.2 60.18,57.18 54.67,57.18 X4.5 50.75,63.6 R8.2
IN4R  (via drill 0.2 pad 0.2)
  Top 0.2: S1.C4 35.81,13.65 37.63,11.84 45.35,11.84 45.38,11.81 57.77,11.81 S2.C4 v64.33,13.65 65.81,13.65 67.63,11.84 75.35,11.84 75.38,11.81 87.77,11.81 S3.C4 95.81,13.65 97.66,11.81 117.77,11.81 S4.C4 125.81,13.65 127.66,11.81 147.77,11.81 S5.C4 155.81,13.65 157.63,11.84 165.35,11.84 165.38,11.81 177.77,11.81 S6.C4 | v62.5,35 62.5,35.5 62,36 60.5,36 59.86,36.64 59.86,57.29 X4.2
  Bottom 0.2: J3.9 v62.5,35 62.5,33.5 61,32 61,22.5 64.33,19.16 v64.33,13.65 | J1.9 69.5,54.49 64.29,59.7 58.46,59.7 X4.2 57.95,62.9 R7.2
IN5L  (via drill 0.2 pad 0.2)
  Top 0.2: S1.A5 23.78,24.27 25.59,26.09 39.41,26.09 S2.A5 53.41,24.27 54.89,25.75 v59.75,25.75 69.75,25.75 S3.A5 83.36,24.27 85.18,26.09 99.41,26.09 S4.A5 104.59,24.27 104.66,24.35 107.3,24.35 107.48,24.52 112.83,24.52 114.4,26.09 129.41,26.09 S5.A5 143.13,24.27 144.94,26.09 159.41,26.09 S6.A5 | v72,39 72,43 67.5,47.5 67.5,58.35 X5.5
  Bottom 0.2: v59.75,25.75 59.75,32.25 60.5,33 J3.7 60.5,36 61.5,37 70,37 v72,39 | J1.7 71.5,54.35 X5.5 64.75,63.6 R10.2
IN5R  (via drill 0.2 pad 0.2)
  Top 0.2: S6.C5 164.91,8.73 163.09,6.91 158.84,6.91 157.02,8.73 S5.C5 135.08,8.73 134.77,8.42 134.75,8.42 133.04,6.72 130.41,6.72 127.98,9.15 117.2,9.15 S4.C5 105.08,8.73 103.26,6.91 100.47,6.91 98.66,8.73 S3.C5 75.04,8.73 73.22,6.91 70.41,6.91 67.5,9.83 v63,9.83 59.81,9.83 58.7,8.73 S2.C5 56.02,9.48 45.48,9.48 42.91,6.91 28.59,6.91 S1.C5 | X5.2 73.5,57.65 v73.5,40
  Bottom 0.2: v63,9.83 63,18.5 58.5,23 J3.5 58.5,36 60.5,38 69.5,38 71.5,40 v73.5,40 | 71.99,59 X5.2 | 71.99,59 73.5,57.49 J1.5 | R9.2 71.99,62.86 71.99,59
IN6L  (via drill 0.2 pad 0.2)
  Top 0.2: S1.A6 18.85,27.12 20.67,28.93 44.34,28.93 S2.A6 47.5,27.12 49.39,29 55,29 55.5,28.5 v57,28.5 74.77,28.5 S3.A6 77.95,27.12 79.47,28.64 104.64,28.64 S4.A6 108.14,27.12 110.02,29 134.27,29 S5.A6 137.78,27.12 139.33,28.67 143.83,28.67 144.61,27.89 165.39,27.89 S6.A6 | v64.5,39 65.5,40 68,40 70,38 83.64,38 86.14,40.5 86.14,43.47 80,49.62 80,59.85 X6.5
  Bottom 0.2: v57,28.5 56.5,29 J3.3 56.5,38 57.5,39 v64.5,39 | J1.3 75.5,51.06 79,54.56 79,60.85 X6.5 78.75,63.6 R12.2
IN6R  (via drill 0.2 pad 0.2)
  Top 0.2: S1.C6 43.38,5.88 45.2,7.7 50.03,7.7 S2.C6 57.21,5.88 60.2,8.88 67.1,8.88 70.02,5.96 73.61,5.96 75.43,7.77 79.95,7.77 S3.C6 103.58,5.88 105.48,7.77 109.95,7.77 S4.C6 112.46,6.5 117.91,6.5 119.61,8.2 127.58,8.2 130.02,5.76 133.44,5.76 135.14,7.47 135.17,7.47 135.48,7.77 139.95,7.77 S5.C6 163.59,5.88 165.4,7.7 170.03,7.7 S6.C6 | v67,39 69,37 84.5,37 87.86,40.36 87.86,44.14 85.95,46.05 X6.2
  Bottom 0.2: S2.C6 57,5.88 62,10.88 62,13.84 54.5,21.34 J3.1 54.5,38.5 56,40 66,40 v67,39 | J1.1 85.95,57.4 85.95,59 X6.2 85.95,62.9 R11.2
N$63
  Bottom 0.2: IC14.5 173.49,17.75 S6.C
N$64
  Bottom 0.2: IC14.3 169.79,10.19 168.91,10.19 166.13,12.97 S6.A
N$65
  Bottom 0.2: IC13.3 139.79,10.19 138.91,10.19 136.13,12.97 S5.A
N$66
  Bottom 0.2: S4.A 106.13,12.97 108.91,10.19 109.79,10.19 IC12.3
N$67
  Bottom 0.2: IC9.3 19.79,10.19 18.91,10.19 16.13,12.97 S1.A
N$68
  Bottom 0.2: IC12.5 111.87,17.31 S4.C
N$69
  Bottom 0.2: S2.A 46.13,12.97 48.91,10.19 49.79,10.19 IC10.3
N$70
  Bottom 0.2: IC13.5 141.87,17.31 S5.C
N$71
  Bottom 0.2: IC11.5 81.87,17.31 S3.C
N$72
  Bottom 0.2: S3.A 76.13,12.97 78.91,10.19 79.79,10.19 IC11.3
N$73
  Bottom 0.2: IC10.5 51.87,17.31 S2.C
N$74
  Bottom 0.2: S1.C 21.87,17.31 IC9.5
OUT1L  (via drill 0.2 pad 0.2)
  Top 0.2: v14,30.5 16.5,33 97,33 | 97,33 97,38 100,41 100,44 104,48 104,60.85 X7.5 | v171,32 147.5,32 146.5,33 97,33
  Bottom 0.2: J2.23 150.5,50 149.5,51 113.85,51 X7.5 103.75,63.6 R14.2 | IC9.1 IC9.2 21.61,11.12 22.03,11.54 22.03,12.47 13,21.5 13,29.5 v14,30.5 | J4.23 171.5,32.5 v171,32
OUT1R  (via drill 0.2 pad 0.2)
  Top 0.2: v15,29.5 17.5,32 v98.5,32 146,32 147,31 v169,31 | v98.5,34 98.5,37.5 101.5,40.5 101.5,43.5 103,45 108,45 111,48 110.95,48.05 X7.2
  Bottom 0.2: J2.21 152.5,51 151.5,52 115,52 110.95,56.05 X7.2 110.95,62.9 R13.2 | IC9.7 IC9.6 23.6,14 22.5,14 14.5,22 14.5,29 v15,29.5 | v169,31 169.5,31.5 J4.21 | v98.5,34 v98.5,32
OUT2L  (via drill 0.2 pad 0.2)
  Top 0.2: v44,30.5 44.43,30.93 v114,30.93 145.5,30.93 146.43,30 v167,30 | v114.5,41 114.5,46 118,49.5 118,60.85 X8.5
  Bottom 0.2: J2.19 154.5,51 152.5,53 125.85,53 X8.5 117.75,63.6 R16.2 | IC10.1 IC10.2 51.61,11.12 52.03,11.54 52.03,12.47 43,21.5 43,29.5 v44,30.5 | v167,30 167.5,30.5 J4.19 | v114.5,41 114.5,31.43 v114,30.93
OUT2R  (via drill 0.2 pad 0.2)
  Top 0.2: v45.5,30 v115.5,30 144.5,30 145.5,29 v165,29 | v116,41 116,44 117,45 122,45 124.95,47.95 X8.2
  Bottom 0.2: J2.17 156.5,51.5 154,54 127,54 125,56 125,59.2 | 125,59.2 X8.2 | IC10.7 IC10.6 53.6,14 52.5,14 44.5,22 44.5,29 v45.5,30 | v165,29 165.5,29.5 J4.17 | v116,41 116,30.5 v115.5,30 | R15.2 125,62.85 125,59.2
OUT3L  (via drill 0.2 pad 0.2)
  Top 0.2: 128.5,40 159.5,40 163.5,36 J4.15 | 128.5,40 128.5,46 132,49.5 132,60.85 X9.5 | 128.5,40 102.5,40 v101.5,39
  Bottom 0.2: J2.15 158.5,51 154.5,55 148.5,55 145.5,58 142,58 141,57 135.85,57 X9.5 131.75,63.6 R18.2 | IC11.1 IC11.2 82.5,11.1 82.5,12 78.5,16 78.5,21 85.5,28 97,28 100,31 100,37.5 v101.5,39
  other vias: 163.5,35.05
OUT3R  (via drill 0.2 pad 0.2)
  Top 0.2: J4.13 161.5,36 158.5,39 v130,39 103,39 v102,38 | v130,41 130,44 131,45 134,45 138.95,49.95 X9.2
  Bottom 0.2: J2.13 160.5,50.5 155,56 149,56 145.8,59.2 X9.2 138.95,62.9 R17.2 | IC11.7 IC11.6 83.6,14 82.5,14 80,16.5 80,20.5 86,26.5 98.5,26.5 101.5,29.5 101.5,37.5 v102,38 | v130,41 v130,39
  other vias: 161.5,35.05
OUT4L  (via drill 0.2 pad 0.2)
  Top 0.2: v142,41 142,44 146,48 146,60.85 X10.5 | J4.11 159.5,36 157.5,38 142.02,38 v142,38.02 141.98,38 111.5,38 v110.5,37
  Bottom 0.2: J2.11 162.5,54.5 159,58 156,58 155,57 149.85,57 X10.5 143.65,64 R20.2 | IC12.1 IC12.2 112.5,11.1 112.5,12 108.5,16 108.5,35 v110.5,37 | v142,41 v142,38.02
  other vias: 159.5,35.05
OUT4R  (via drill 0.2 pad 0.2)
  Top 0.2: J4.9 157.5,36 156.5,37 143.52,37 v143.5,37.02 143.5,37 112,37 v111,36 | v143.5,41 143.5,43 145.25,44.75 150.75,44.75 152.95,46.95 X10.2
  Bottom 0.2: J2.9 164.5,54.5 159.3,59.7 153.46,59.7 X10.2 152.95,62.9 R19.2 | IC12.7 IC12.6 113.6,14 112.5,14 110,16.5 110,35 v111,36 | v143.5,41 v143.5,37.02
  other vias: 157.5,35.05
OUT5L  (via drill 0.2 pad 0.2)
  Top 0.2: v144,34.52 145.48,36 154.55,36 J4.7 | v158,44.5 160,46.5 160,60.85 X11.5
  Bottom 0.2: IC13.1 IC13.2 142.5,11.1 142.5,12 138,16.5 138,28.52 v144,34.52 | J4.7 155.5,37.5 158,40 v158,44.5 | J2.7 166.5,54.35 X11.5 157.65,64 R22.2
  other vias: 155.5,35.05
OUT5R  (via drill 0.2 pad 0.2)
  Top 0.2: J4.5 153.5,35 146.48,35 v145,33.52 | v161,47 161.5,47 162.5,48 162.5,50 166.95,54.45 X11.2
  Bottom 0.2: X11.2 166.99,59 | IC13.7 IC13.6 143.6,14 142.5,14 139.5,17 139.5,28.02 v145,33.52 | v161,47 159,47 157,45 157,41 153.5,37.5 J4.5 | R21.2 166.99,62.86 166.99,59 | J2.5 168.5,57.49 166.99,59
  other vias: 153.5,35.05
OUT6L  (via drill 0.2 pad 0.2)
  Top 0.2: v151.5,34 169,34 169.5,34.5 169.5,37 170.5,38 170.5,45 174,48.5 174,60.85 X12.5
  Bottom 0.2: IC14.1 IC14.2 172.65,11.25 173.25,11.25 174,10.5 174,9 172.5,7.5 169,7.5 163.5,13 163.5,19.5 159.5,23.5 153.5,23.5 151.5,25.5 v151.5,34 J4.3 | J2.3 170.5,51 174,54.5 174,60.85 X12.5 173.75,63.6 R24.2
OUT6R  (via drill 0.2 pad 0.2)
  Top 0.2: v149.5,33 171,33 171.5,33.5 171.5,37 172,37.5 172,44.5 172.75,45.25 179.25,45.25 180.95,46.95 X12.2
  Bottom 0.2: IC14.7 IC14.6 173.5,13.9 173.5,13 175,11.5 175,4.5 174,3.5 164,3.5 163.25,4.25 163.25,10.75 161.5,12.5 161.5,19 159,21.5 153,21.5 149.5,25 v149.5,33 J4.1 | J2.1 173.95,48.95 181,56 180.95,56.05 X12.2 180.95,62.9 R23.2

### Text on the board
tNames: AudioBürokrat / AB AudoMatrix 6x6 / Input PCB / v3.4 | AudioBürokrat / AB AudoMatrix 6x6 / Output PCB / v3.4 | AudioBürokrat / AB AudoMatrix 6x6 / Schalter PCB / v3.4
bNames: IN | OUT | IN | OUT